# EAGLE design 5draft_onBoard_rework2 (EAGLE 8.1.0)
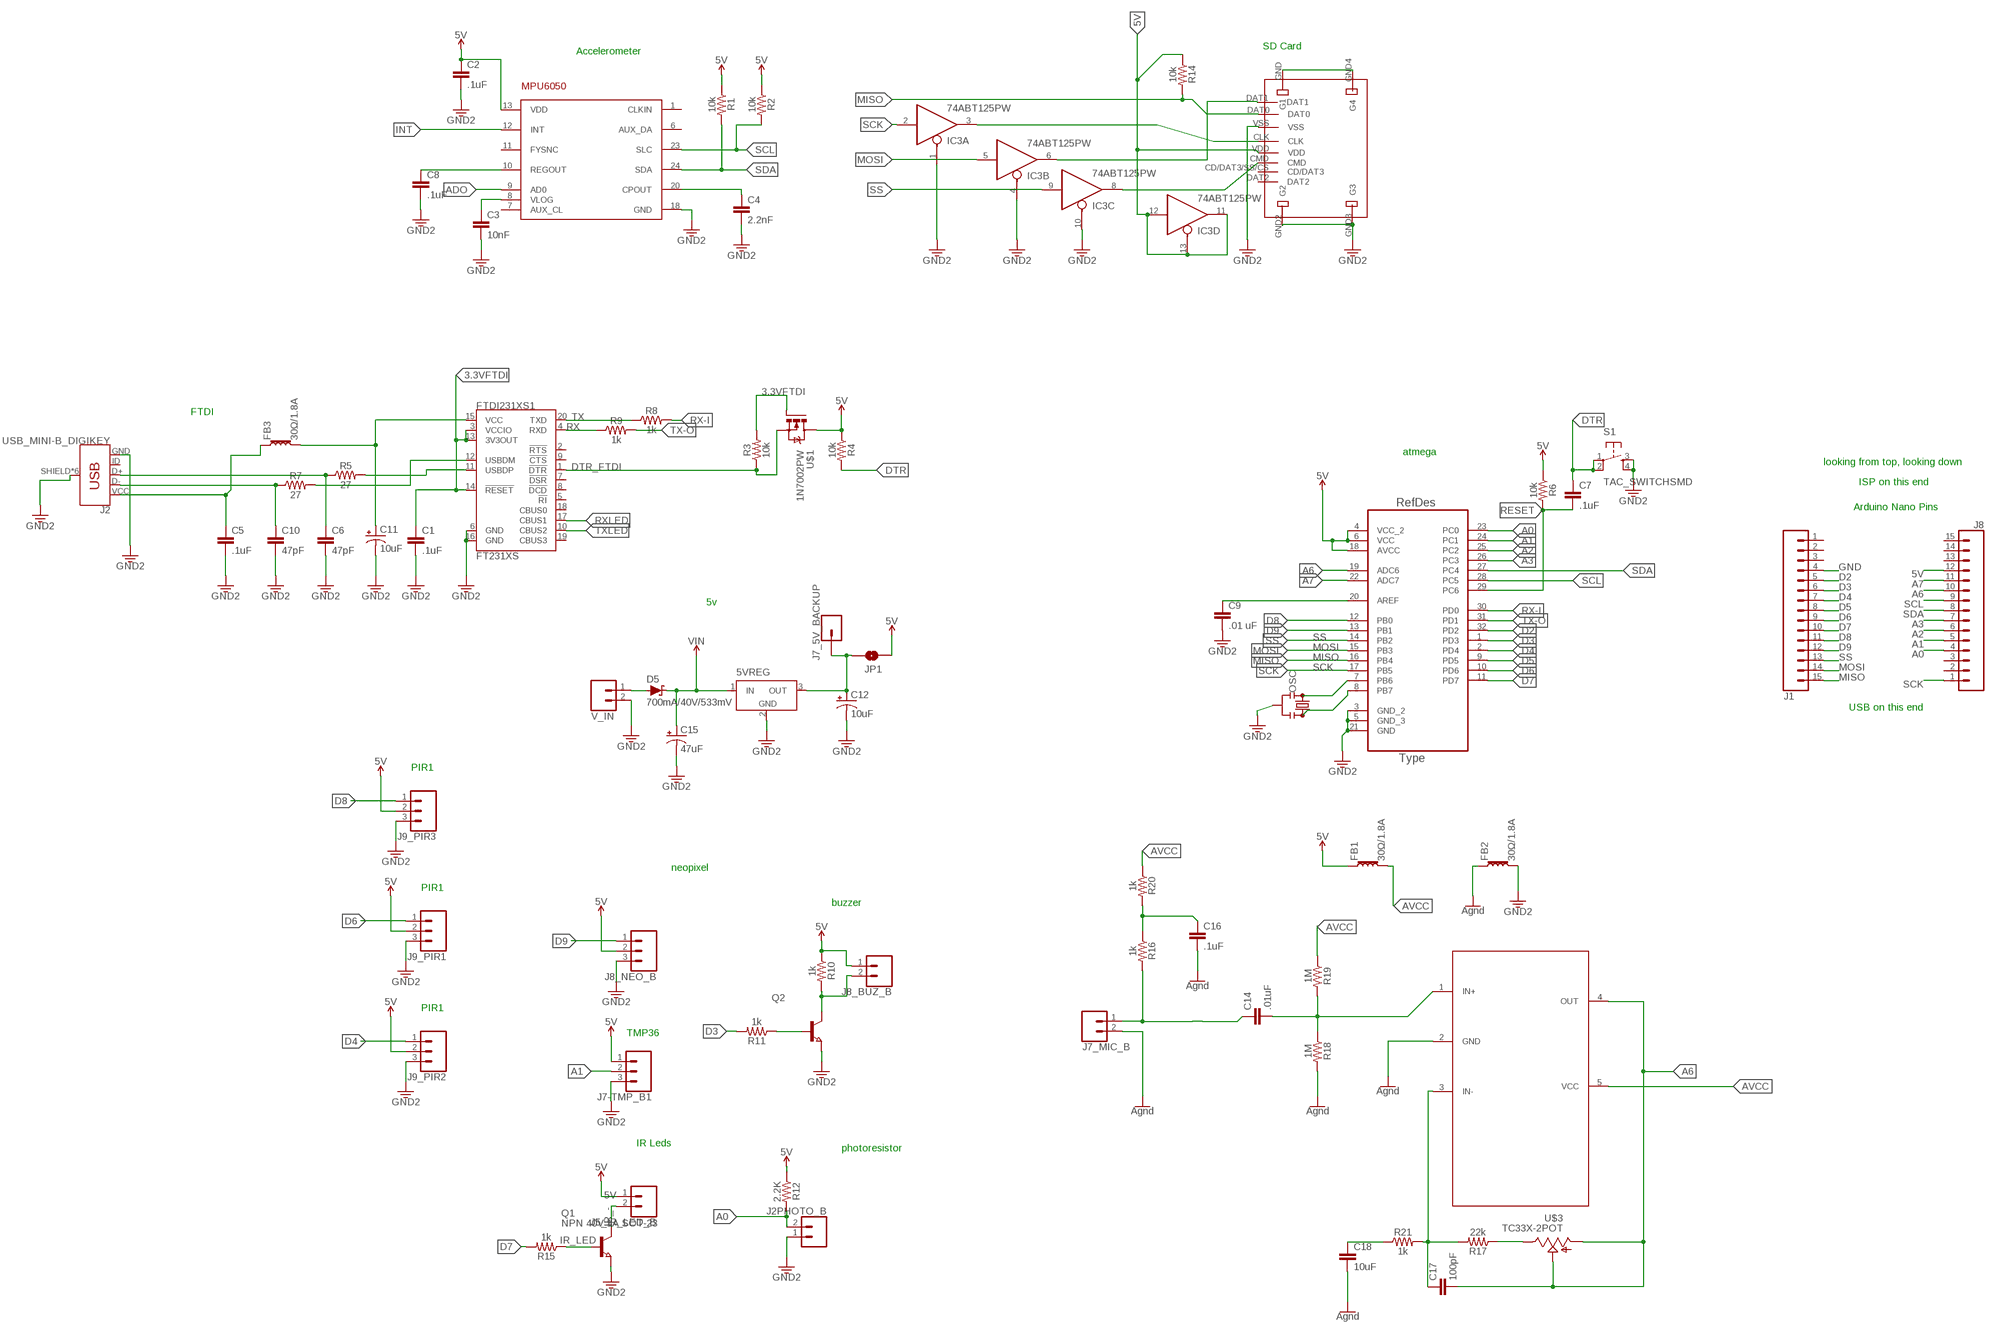
[diagram p0: schematic, sheet 1]

## Parts
5VREG  LT1129CST5  [SOT223]
ATMEGA328P-AU  ATMEGA328P-AU  [QFP80P900X900X120-32N]
C1  .1uF  .22UF-CER  [0402-CAP]
C2  .1uF  .22UF-CER  [0402-CAP]
C3  10nF  .22UF-CER  [0402-CAP]
C4  2.2nF  .22UF-CER  [0402-CAP]
C5  .1uF  .22UF-CER  [0402-CAP]
C6  47pF  .22UF-CER  [0402-CAP]
C7  .1uF  .22UF-CER  [0402-CAP]
C8  .1uF  .22UF-CER  [0402-CAP]
C9  .01 uF  .22UF-CER  [0402-CAP]
C10  47pF  .22UF-CER  [0402-CAP]
C11  10uF  10UF-TANT  [EIA3216]
C12  10uF  10UF-TANT  [EIA3216]
C14  .01uF  .22UF-CER  [0402-CAP]
C15  47uF  10UF-TANT  [EIA3216]
C16  .1uF  .22UF-CER  [0402-CAP]
C17  100pF  .22UF-CER  [0402-CAP]
C18  10uF  .22UF-CER  [0402-CAP]
D5  700mA/40V/533mV  DIODE-SCHOTTKY-ZLLS500  [SOT23-3]
FB1  30Ω/1.8A  FERRITE_BEAD-0603  [0603]
FB2  30Ω/1.8A  FERRITE_BEAD-0603  [0603]
FB3  30Ω/1.8A  FERRITE_BEAD-0603  [0603]
FTDI231XS1  FT231XS  [SSOP20_L]
IC3  74ABT125PW  [TSSOP14]
IC4  MAX4466KS  [SC70-5]
J1  CONN_15  [1X15]
J2  USB_MINI-B_DIGIKEY  [MICRO-USB-DIGIKEY-FCI2]
J2PHOTO_B  CONN_02LOCK  [1X02_LOCK]
J5_IR_LED_B  CONN_02LOCK  [1X02_LOCK]
J7-TMP_B1  CONN_03  [1X03]
J7_5V_BACKUP  CONN_01  [1X01]
J7_MIC_B  CONN_02LOCK  [1X02_LOCK]
J8  CONN_15  [1X15]
J8_BUZ_B  CONN_02LOCK  [1X02_LOCK]
J8_NEO_B  CONN_03  [1X03]
J9_PIR1  CONN_03  [1X03]
J9_PIR2  CONN_03  [1X03]
J9_PIR3  CONN_03  [1X03]
JP1  JUMPER-SMT_2_NO_NO-SILK_ROUND  [SMT-JUMPER_2_NO_NO-SILK_ROUND]
MPU6050  MPU-6050  [QFN24-4X4]
OSC  RESONATORSMD-3.2X1.3  [RESONATOR-SMD-3.2X1.3]
Q1  NPN 40V 1A SOT-23  NPN-TRANSISTOR_SOT23  [SOT23]
Q2  NPN-TRANSISTOR_SOT23  [SOT23]
R1  10k  0.05OHM-0603-1/5W-1%  [0603]
R2  10k  0.05OHM-0603-1/5W-1%  [0603]
R3  10k  0.05OHM-0603-1/5W-1%  [0603]
R4  10k  0.05OHM-0603-1/5W-1%  [0603]
R5  27  0.05OHM-0603-1/5W-1%  [0603]
R6  10k  0.05OHM-0603-1/5W-1%  [0603]
R7  27  0.05OHM-0603-1/5W-1%  [0603]
R8  1k  0.05OHM-0603-1/5W-1%  [0603]
R9  1k  0.05OHM-0603-1/5W-1%  [0603]
R10  1k  0.05OHM-0603-1/5W-1%  [0603]
R11  1k  0.05OHM-0603-1/5W-1%  [0603]
R12  2.2K  0.05OHM-0603-1/5W-1%  [0603]
R14  10k  0.05OHM-0603-1/5W-1%  [0603]
R15  1k  0.05OHM-0603-1/5W-1%  [0603]
R16  1k  0.05OHM-0603-1/5W-1%  [0603]
R17  22k  0.05OHM-0603-1/5W-1%  [0603]
R18  1M  0.05OHM-0603-1/5W-1%  [0603]
R19  1M  0.05OHM-0603-1/5W-1%  [0603]
R20  1k  0.05OHM-0603-1/5W-1%  [0603]
R21  1k  0.05OHM-0603-1/5W-1%  [0603]
S1  TAC_SWITCHSMD  [TACTILE-SWITCH-SMD]
U$1  1N7002PW  [SOT323W_INFINEON]
U$2  WM6698TR-ND_MICROSD  [MICROSD2]
U$3  TC33X-2POT  [TC33X-2]
V_IN  CONN_02LOCK  [1X02_LOCK]

## Nets
2.2NF: C4.1 MPU6050.20(CPOUT)
3.3VFTDI: C1.1 FTDI231XS1.3(VCCIO) FTDI231XS1.13(3V3OUT) FTDI231XS1.14(!RESET) R3.2 U$1.1(G)
5REGOUT: 5VREG.3(OUT) C12.A(+) J7_5V_BACKUP.1 JP1.2
5V: ATMEGA328P-AU.4(VCC_2) ATMEGA328P-AU.6(VCC) ATMEGA328P-AU.18(AVCC) C2.1 FB1.1 IC3.11(D:O) IC3.12(D:I) IC3.13(D:OE) J5_IR_LED_B.1 J7-TMP_B1.1 J8.12 J8_NEO_B.2 J9_PIR1.2 J9_PIR2.2 J9_PIR3.2 JP1.1 MPU6050.13(VDD) R1.1 R2.1 R4.1 R6.1 R12.1 R14.1 U$1.3(D) U$2.VDD
10NF: C3.1 MPU6050.8(VLOG)
.UF: C8.1 MPU6050.10(REGOUT)
A0: ATMEGA328P-AU.23(PC0) J2PHOTO_B.2 J8.4 R12.2
A1: ATMEGA328P-AU.24(PC1) J7-TMP_B1.2 J8.5
A2: ATMEGA328P-AU.25(PC2) J8.6
A3: ATMEGA328P-AU.26(PC3) J8.7
A6: ATMEGA328P-AU.19(ADC6) C17.2 IC4.4(OUT) J8.10 U$3.2 U$3.3
A7: ATMEGA328P-AU.22(ADC7) J8.11
ADO: MPU6050.9(AD0)
AVCC: FB1.2 IC4.5(VCC) R19.1 R20.1
BUZ+: J8_BUZ_B.1 R10.1 ; supply symbol labelled 5V
BUZ-: J8_BUZ_B.2 Q2.3(C) R10.2
D2: ATMEGA328P-AU.32(PD2) J1.5
D3: ATMEGA328P-AU.1(PD3) J1.6 R11.2
D4: ATMEGA328P-AU.2(PD4) J1.7 J9_PIR2.1
D5: ATMEGA328P-AU.9(PD5) J1.8
D6: ATMEGA328P-AU.10(PD6) J1.9 J9_PIR1.1
D7: ATMEGA328P-AU.11(PD7) J1.10 R15.2
D8: ATMEGA328P-AU.12(PB0) J1.11 J9_PIR3.1
D9: ATMEGA328P-AU.13(PB1) J1.12 J8_NEO_B.1
DAT1: IC3.6(B:O) U$2.DAT1
DN+_P: C6.1 J2.D+ R5.1
DN_N: C10.1 J2.D- R7.1
DTR: C7.1 R4.2 S1.1 S1.2
DTR_FTDI: FTDI231XS1.1(!DTR) R3.1 U$1.2(S)
GND: 5VREG.2(GND) ATMEGA328P-AU.3(GND_2) ATMEGA328P-AU.5(GND_3) ATMEGA328P-AU.21(GND) C1.2 C2.2 C3.2 C4.2 C5.2 C6.2 C8.2 C9.2 C10.2 C11.C(-) C12.C(-) C15.C(-) C16.2 C18.2 FB2.1 FB2.2 FTDI231XS1.6(GND) FTDI231XS1.16(GND) IC3.1(A:OE) IC3.4(B:OE) IC3.10(C:OE) IC4.2(GND) J1.4 J2.GND J2.SHIELD J2.SHIELD1(SHIELD) J2.SHIELD2(SHIELD) J2.SHIELD3(SHIELD) J2.SHIELD4(SHIELD) J2.SHIELD5(SHIELD) J2PHOTO_B.1 J7-TMP_B1.3 J7_MIC_B.2 J8_NEO_B.3 J9_PIR1.3 J9_PIR2.3 J9_PIR3.3 MPU6050.18(GND) OSC.2 Q1.2(E) Q2.2(E) R18.2 S1.3 S1.4 U$2.GND2(G2) U$2.GND3(G3) U$2.GND4(G4) U$2.GND(G1) U$2.VSS V_IN.2 ; supply symbol labelled GND2, Agnd
INT: MPU6050.12(INT)
IR_-: J5_IR_LED_B.2 Q1.3(C)
IR_LED: Q1.1(B) R15.1
MIC_IN+: C14.2 IC4.1(IN+) R18.1 R19.2
MIC_IN_C14: C14.1 J7_MIC_B.1 R16.2
MICNET1K: C16.1 R16.1 R20.2
MISO: ATMEGA328P-AU.16(PB4) J1.15 R14.2 U$2.DAT0
MOSI: ATMEGA328P-AU.15(PB3) IC3.5(B:I) J1.14
N$6: ATMEGA328P-AU.20(AREF) C9.1
N$12: R17.1 U$3.1
N$20: Q2.1(B) R11.1
N$22: D5.1(A) V_IN.1
N$29: C18.1 R21.1
N$30: C17.1 IC4.3(IN-) R17.2 R21.2
PB6: ATMEGA328P-AU.7(PB6) OSC.1
PB7: ATMEGA328P-AU.8(PB7) OSC.3
RESET: ATMEGA328P-AU.29(PC6) C7.2 R6.2
RX: FTDI231XS1.4(RXD) R9.1
RX-I: ATMEGA328P-AU.30(PD0) R8.2
RXLED: FTDI231XS1.17(CBUS1)
SCK: ATMEGA328P-AU.17(PB5) IC3.2(A:I) J8.1
SCK_BUFF: IC3.3(A:O) U$2.CLK
SCL: ATMEGA328P-AU.28(PC5) J8.9 MPU6050.23(SLC) R2.2
SDA: ATMEGA328P-AU.27(PC4) J8.8 MPU6050.24(SDA) R1.2
SS: ATMEGA328P-AU.14(PB2) IC3.9(C:I) J1.13
SS_BUFF: IC3.8(C:O) U$2.CMD
TX: FTDI231XS1.20(TXD) R8.1
TX-O: ATMEGA328P-AU.31(PD1) R9.2
TXLED: FTDI231XS1.10(CBUS2)
USBD_M: FTDI231XS1.12(USBDM) R7.2
USBD_P: FTDI231XS1.11(USBDP) R5.2
VIN: 5VREG.1(IN) C15.A(+) D5.3(C)
VUSB: C5.1 C11.A(+) FB3.1 FB3.2 FTDI231XS1.15(VCC) J2.VCC(VBUS)
Unconnected: FTDI231XS1.2(!RTS) FTDI231XS1.5(!RI) FTDI231XS1.7(!DSR) FTDI231XS1.8(!DCD) FTDI231XS1.9(!CTS) FTDI231XS1.18(CBUS0) FTDI231XS1.19(CBUS3) J1.1 J1.2 J1.3 J2.ID J8.2 J8.3 J8.13 J8.14 J8.15 MPU6050.1(CLKIN) MPU6050.6(AUX_DA) MPU6050.7(AUX_CL) MPU6050.11(FYSNC) U$2.CD/DAT3/SS/CS(CD/DAT3) U$2.DAT2

## Notes on the sheet
- SD Card
- Accelerometer
- FTDI
- atmega
- looking from top, looking down
- ISP on this end
- Arduino Nano Pins
- 5v
- USB on this end
- PIR1
- neopixel
- PIR1
- buzzer
- PIR1
- TMP36
- IR Leds
- photoresistor

## Power pins joined to a net without a drawn wire
AVCC: IC3.14(P:VCC)
GND: 5VREG.4(GND) IC3.7(P:GND)

## Library data of the parts
5VREG = linear-technology:LT1129CST5: VOLTAGE REGULATOR with shutdown; MPN: LT1129CST-5#PBF; OC_FARNELL: 1663375; OC_NEWARK: 57M2069
ATMEGA328P-AU = Atmega-328pu:ATMEGA328P-AU; DESCRIPTION: 8-bit Microcontroller with In-System Programmable Flash; MPN: ATMEGA328P-AU; OC_FARNELL: 1715486; OC_NEWARK: 14R4631; PACKAGE: TQFP-32; SUPPLIER: Atmel
C1-C10 C14 C16-C18 = SparkFun-Retired:.22UF-CER: .22uF ceramic SMT CAP-09885- 50V +80%/-20% (0603); PROD_ID: CAP-09885; VALUE: .22uF
C11 C12 = SparkFun-Retired:10UF-TANT: 10uF Tantalum SMT CAP-00811- 16V 10% (EIA-3216); PROD_ID: CAP-00811
C15 = SparkFun-Retired:10UF-TANT: 10uF Tantalum SMT CAP-00811- 16V 10% (EIA-3216); PROD_ID: CAP-00811; VALUE: 10uF
D5 = SparkFun-DiscreteSemi:DIODE-SCHOTTKY: Schottky diode A Schottky diode is a semiconductor diode which has a low forward voltage drop and a very fast switching action.; PROD_ID: DIO-08411
FB1-FB3 = SparkFun-Coils:FERRITE_BEAD: Ferrite Bead (blocks, cores, rings, chokes, etc.) Inductor with layers of ferrite used to suppress high frequencies. Often used to isolate high frequency noise. SparkFun Products: IOIO-OTG - V2.2 <https://www.sparkfun.com/products/13613> SparkFun SAMD21 Mini Breakout <https://www.sparkfun.com/products/13664> SparkFun 6 Degrees of Freedom Breakout - LSM6DS3 <https://www.sparkfun.com/products/13339> SparkFun SAMD21 Dev Breakout <https://www.sparkfun.com/products/13672>; PROD_ID: NDUC-07859
FTDI231XS1 = SparkFun-IC-Comms:FT231X: FTDI FT231X Full Speed USB to Full-handshake UART This USB2.0 Full Speed IC offers a compact bridge to full handshake UART interfaces. The device is a UART, capable of operating up to 3MBaud, with low power consumption (8mA). The FT231X includes the complete FT-X series feature set and enables USB to be added into a system design quickly and easily over a UART interface. Datasheet <http://cdn.sparkfun.com/datasheets/Components/General%20IC/DS_FT231X.pdf> SparkFun Products SparkFun RedBoard - Programmed with Arduino <https://www.sparkfun.com/products/12757> (DEV-12757) SparkFun XBee Explorer USB <https://www.sparkfun.com/products/11812> (WRL-11812) SparkFun XBee Explorer Dongle <https://www.sparkfun.com/products/11697> (WRL-11697) SparkFun Blynk Board - ESP8266 <https://www.sparkfun.com/products/13794> (WRL-13794) SparkFun ESP8266 Thing - Dev Board <https://www.sparkfun.com/products/13711> (WRL-13711) SparkFun Block for Intel® Edison - Base <https://www.sparkfun.com/products/13045> (DEV-13045) SparkFun RedStick <https://www.sparkfun.com/products/13741> (DEV-13741) SparkFun Beefy 3 - FTDI Basic Breakout <https://www.sparkfun.com/products/13746> (DEV-13746) SparkFun FT231X Breakout <https://www.sparkfun.com/products/11736> (BOB-11736); PROD_ID: IC-11524
IC3 = 74xx-us:74*125: Quad bus BUFFER, 3-state
IC4 = KevinKuwata1:MAX4466: MAX4466 SOT23 SC70 mic amp arduino adafruit sparkfun
J1 J8 = SparkFun-Connectors:CONN_15: Multi connection point. Often used as Generic Header-pin footprint for 0.1 inch spaced/style header connections On any of the 0.1 inch spaced packages, you can populate with these: Break Away Headers - Straight <https://www.sparkfun.com/products/116> (PRT-00116) Break Away Male Headers - Right Angle <https://www.sparkfun.com/products/553> (PRT-00553) Female Headers <https://www.sparkfun.com/products/115> (PRT-00115) Break Away Headers - Machine Pin <https://www.sparkfun.com/products/117> (PRT-00117) Break Away Female Headers - Swiss Machine Pin <https://www.sparkfun.com/products/743> (PRT-00743) For SCREWTERMINALS and SPRING TERMINALS visit here: Screw Terimnals on SparkFun.com <https://www.sparkfun.com/search/results?term=Screw+Terminals> (5mm/3.5mm/2.54mm spacing) This device is also useful as a general connection point to wire up your design to another part of your project. Our various solder wires solder well into these plated through hole pads. Hook-Up Wire - Assortment (Stranded, 22 AWG) <https://www.sparkfun.com/products/11375> (PRT-11375) Hook-Up Wire - Assortment (Solid Core, 22 AWG) <https://www.sparkfun.com/products/11367> (PRT-11367) View the entire wire category on our website here <https://www.sparkfun.com/categories/141> Special notes: Molex polarized connector foot print use with SKU : PRT-08231 with associated crimp pins and housings. 1MM SMD Version SKU: PRT-10208 NOTES ON THE VARIANTS LOCK and LOCK_LONGPADS... This footprint was designed to help hold the alignment of a through-hole component (i.e. 6-pin header) while soldering it into place. You may notice that each hole has been shifted either up or down by 0.005 of an inch from it's more standard position (which is a perfectly straight line). This slight alteration caused the pins (the squares in the middle) to touch the edges of the holes. Because they are alternating, it causes a "brace" to hold the component in place. 0.005 has proven to be the perfect amount of "off-center" position when using our standard breakaway headers. Although looks a little odd when you look at the bare footprint, once you have a header in there, the alteration is very hard to notice. Also,if you push a header all the way into place, it is covered up entirely on the bottom side.
J2 = KevinKuwata1:USB_MINI-B_DIGIKEY: USB type Mini-B Connector Breaks out 5th pin, and includes shield pins if needed. SparkFun Products: SparkFun FTDI Basic Breakout <https://www.sparkfun.com/products/9716> SparkFun XBee Explorer USB <https://www.sparkfun.com/products/11812> SparkFun Redboard <https://www.sparkfun.com/products/12757>
J2PHOTO_B J5_IR_LED_B J7_MIC_B J8_BUZ_B V_IN = SparkFun-Connectors:CONN_02: Multi connection point. Often used as Generic Header-pin footprint for 0.1 inch spaced/style header connections On any of the 0.1 inch spaced packages, you can populate with these: Break Away Headers - Straight <https://www.sparkfun.com/products/116> (PRT-00116) Break Away Male Headers - Right Angle <https://www.sparkfun.com/products/553> (PRT-00553) Female Headers <https://www.sparkfun.com/products/115> (PRT-00115) Break Away Headers - Machine Pin <https://www.sparkfun.com/products/117> (PRT-00117) Break Away Female Headers - Swiss Machine Pin <https://www.sparkfun.com/products/743> (PRT-00743) For SCREWTERMINALS and SPRING TERMINALS visit here: Screw Terimnals on SparkFun.com <https://www.sparkfun.com/search/results?term=Screw+Terminals> (5mm/3.5mm/2.54mm spacing) This device is also useful as a general connection point to wire up your design to another part of your project. Our various solder wires solder well into these plated through hole pads. Hook-Up Wire - Assortment (Stranded, 22 AWG) <https://www.sparkfun.com/products/11375> (PRT-11375) Hook-Up Wire - Assortment (Solid Core, 22 AWG) <https://www.sparkfun.com/products/11367> (PRT-11367) View the entire wire category on our website here <https://www.sparkfun.com/categories/141> Special notes: Molex polarized connector foot print use with: PRT-08233 with associated crimp pins and housings. 2.54_SCREWTERM for use with PRT-10571. 3.5mm Screw Terminal footprints for PRT-08084 5mm Screw Terminal footprints for use with PRT-08432
J7-TMP_B1 J8_NEO_B J9_PIR1-J9_PIR3 = SparkFun-Connectors:CONN_03: Multi connection point. Often used as Generic Header-pin footprint for 0.1 inch spaced/style header connections On any of the 0.1 inch spaced packages, you can populate with these: Break Away Headers - Straight <https://www.sparkfun.com/products/116> (PRT-00116) Break Away Male Headers - Right Angle <https://www.sparkfun.com/products/553> (PRT-00553) Female Headers <https://www.sparkfun.com/products/115> (PRT-00115) Break Away Headers - Machine Pin <https://www.sparkfun.com/products/117> (PRT-00117) Break Away Female Headers - Swiss Machine Pin <https://www.sparkfun.com/products/743> (PRT-00743) Stackable Header - 3 Pin (Female, 0.1") <https://www.sparkfun.com/products/13875> (PRT-13875) For SCREWTERMINALS and SPRING TERMINALS visit here: Screw Terimnals on SparkFun.com <https://www.sparkfun.com/search/results?term=Screw+Terminals> (5mm/3.5mm/2.54mm spacing) This device is also useful as a general connection point to wire up your design to another part of your project. Our various solder wires solder well into these plated through hole pads. Hook-Up Wire - Assortment (Stranded, 22 AWG) <https://www.sparkfun.com/products/11375> (PRT-11375) Hook-Up Wire - Assortment (Solid Core, 22 AWG) <https://www.sparkfun.com/products/11367> (PRT-11367) View the entire wire category on our website here <https://www.sparkfun.com/categories/141> Special notes: Molex polarized connector foot print use with SKU : PRT-08232 with associated crimp pins and housings.
J7_5V_BACKUP = SparkFun-Connectors:CONN_01: Single connection point. Often used as Generic Header-pin footprint for 0.1 inch spaced/style header connections On any of the 0.1 inch spaced packages, you can populate with these: Break Away Headers - Straight <https://www.sparkfun.com/products/116> (PRT-00116) Break Away Male Headers - Right Angle <https://www.sparkfun.com/products/553> (PRT-00553) Female Headers <https://www.sparkfun.com/products/115> (PRT-00115) Break Away Headers - Machine Pin <https://www.sparkfun.com/products/117> (PRT-00117) Break Away Female Headers - Swiss Machine Pin <https://www.sparkfun.com/products/743> (PRT-00743) This device is also useful as a general connection point to wire up your design to another part of your project. Our various solder wires solder well into these plated through hole pads. Hook-Up Wire - Assortment (Stranded, 22 AWG) <https://www.sparkfun.com/products/11375> (PRT-11375) Hook-Up Wire - Assortment (Solid Core, 22 AWG) <https://www.sparkfun.com/products/11367> (PRT-11367) View the entire wire category on our website here <https://www.sparkfun.com/categories/141> Special notes: SMTSO-256-ET is a "flush mount" nut for a 4-40 screw. We mostly use this on specialty testbeds; it is a nice way to connect hardware to your PCB at an adjustable hieght. Also note, the SNAP packages are for using a snappable style connector. We sell a baggie of snaps and they are also used on two LilyPad designs: Snap Assortment - 30 pack (male and female) <https://www.sparkfun.com/products/11347> (DEV-11347) LilyPad Arduino SimpleSnap <https://www.sparkfun.com/products/10941> (DEV-10941) LilyPad SimpleSnap Protoboard <https://www.sparkfun.com/products/10940> (DEV-10940)
JP1 = SparkFun-Jumpers:JUMPER-SMT_2_NO: Normally open jumper This jumper has two pads in close proximity to each other. Apply solder to close the connection. Round pads are easier to solder for beginners, but are a lot larger. SparkFun Product that uses the round pads: SparkFun EL Sequencer <https://www.sparkfun.com/products/12781>
MPU6050 = KevinKuwata1:MPU-6050
OSC = SparkFun-Clocks:RESONATOR: Resonators (Generic) Ceramic resonators are clock-generating components, often used to control timing in microcontrollers. They usually have 3 pins: two pins for oscillation, and one pin for ground. Compared to crystals, resonators have worse tolerance, but are usually much cheaper. Plus, they have built-in load capacitors! These devices are used on boards like the Arduino Pro 8MHz <https://www.sparkfun.com/products/11114> and Arduino Pro 16MHz <https://www.sparkfun.com/products/11113>.
Q1 Q2 = semicon-smd-ipc:NPN-TRANSISTOR_: NPN TRANSISTOR
R1-R12 R14-R21 = SparkFun-Resistors:0.05OHM: 0.05Ω resistor A resistor is a passive two-terminal electrical component that implements electrical resistance as a circuit element. Resistors act to reduce current flow, and, at the same time, act to lower voltage levels within circuits. - Wikipedia; PROD_ID: RES-12535; VALUE: 0.05
S1 = SparkFun-Retired:TAC_SWITCH: Momentary Switch Button commonly used for reset or general input. Spark Fun Electronics SKU : COM-00097 SMT- SWCH-08247; PROD_ID: SWCH-08247
U$1 = KevinKuwata1:1N7002PW
U$2 = KevinKuwata1:WM6698TR-ND_MICROSD
U$3 = KevinKuwata1:TC33X-2POT

## Net classes
0 default: clearance 0.051 mm

## Board
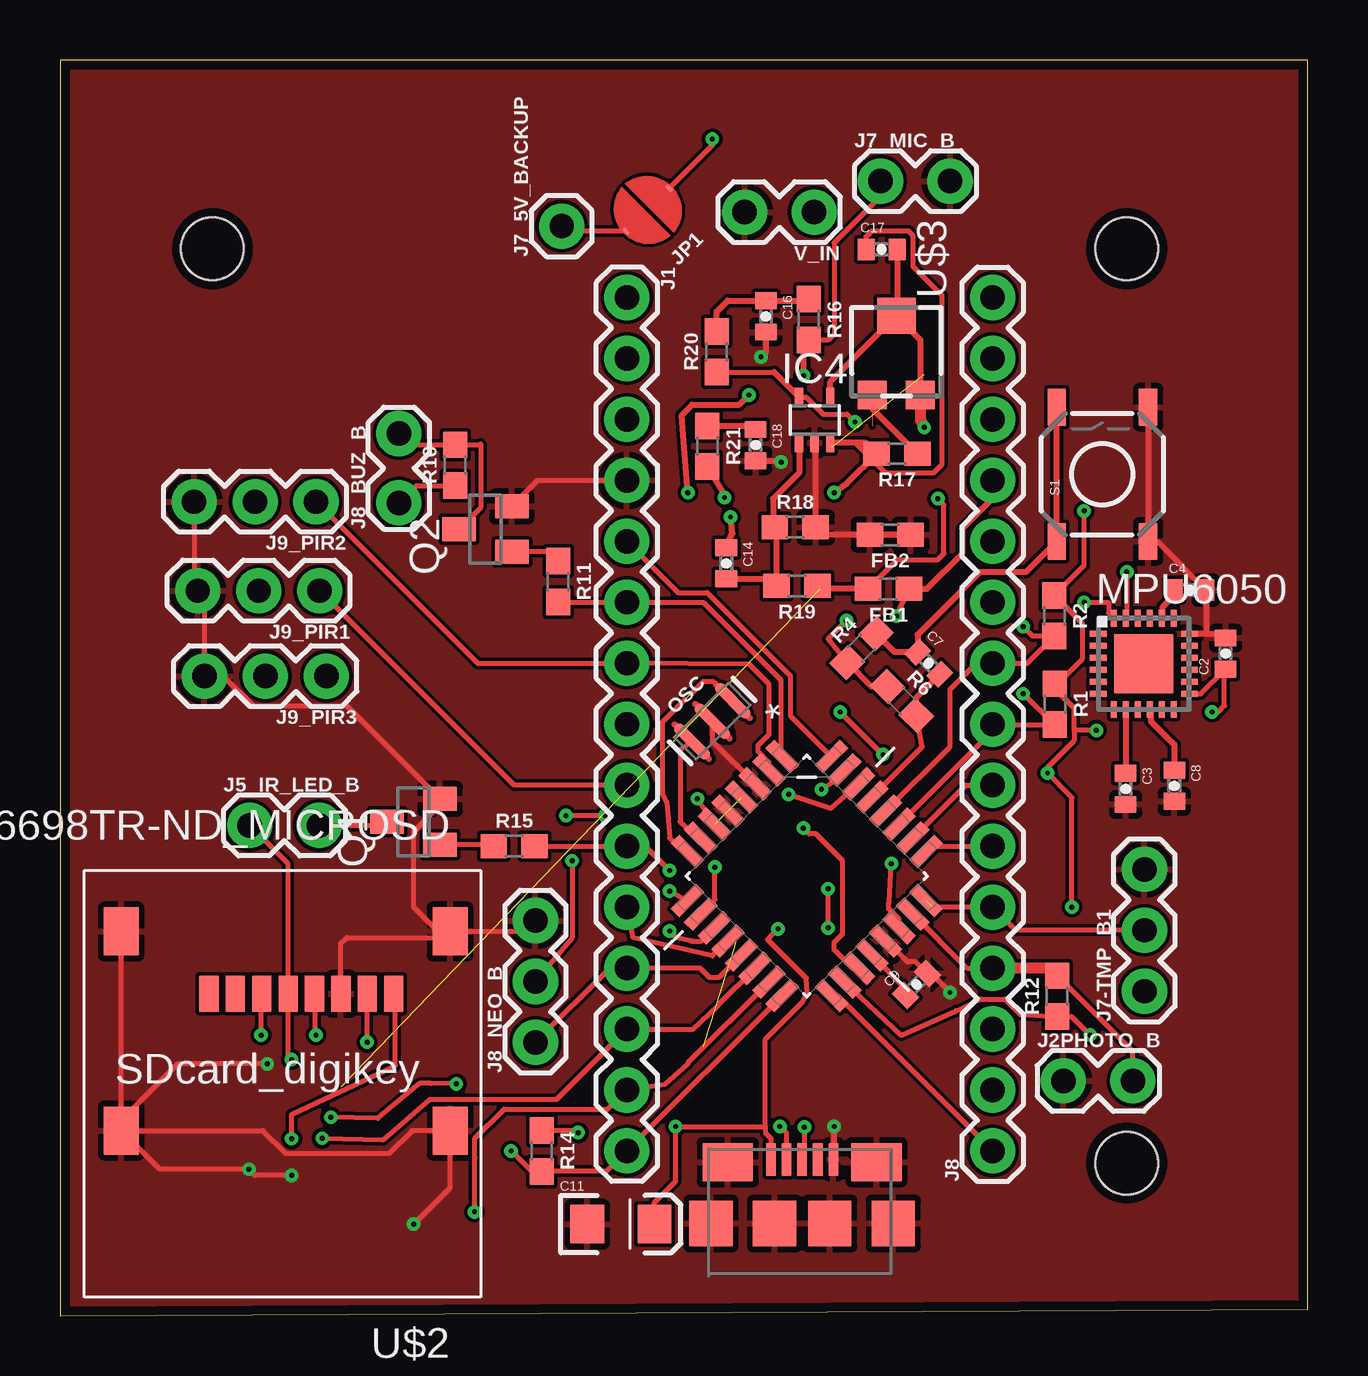
[diagram p1: board, top side]
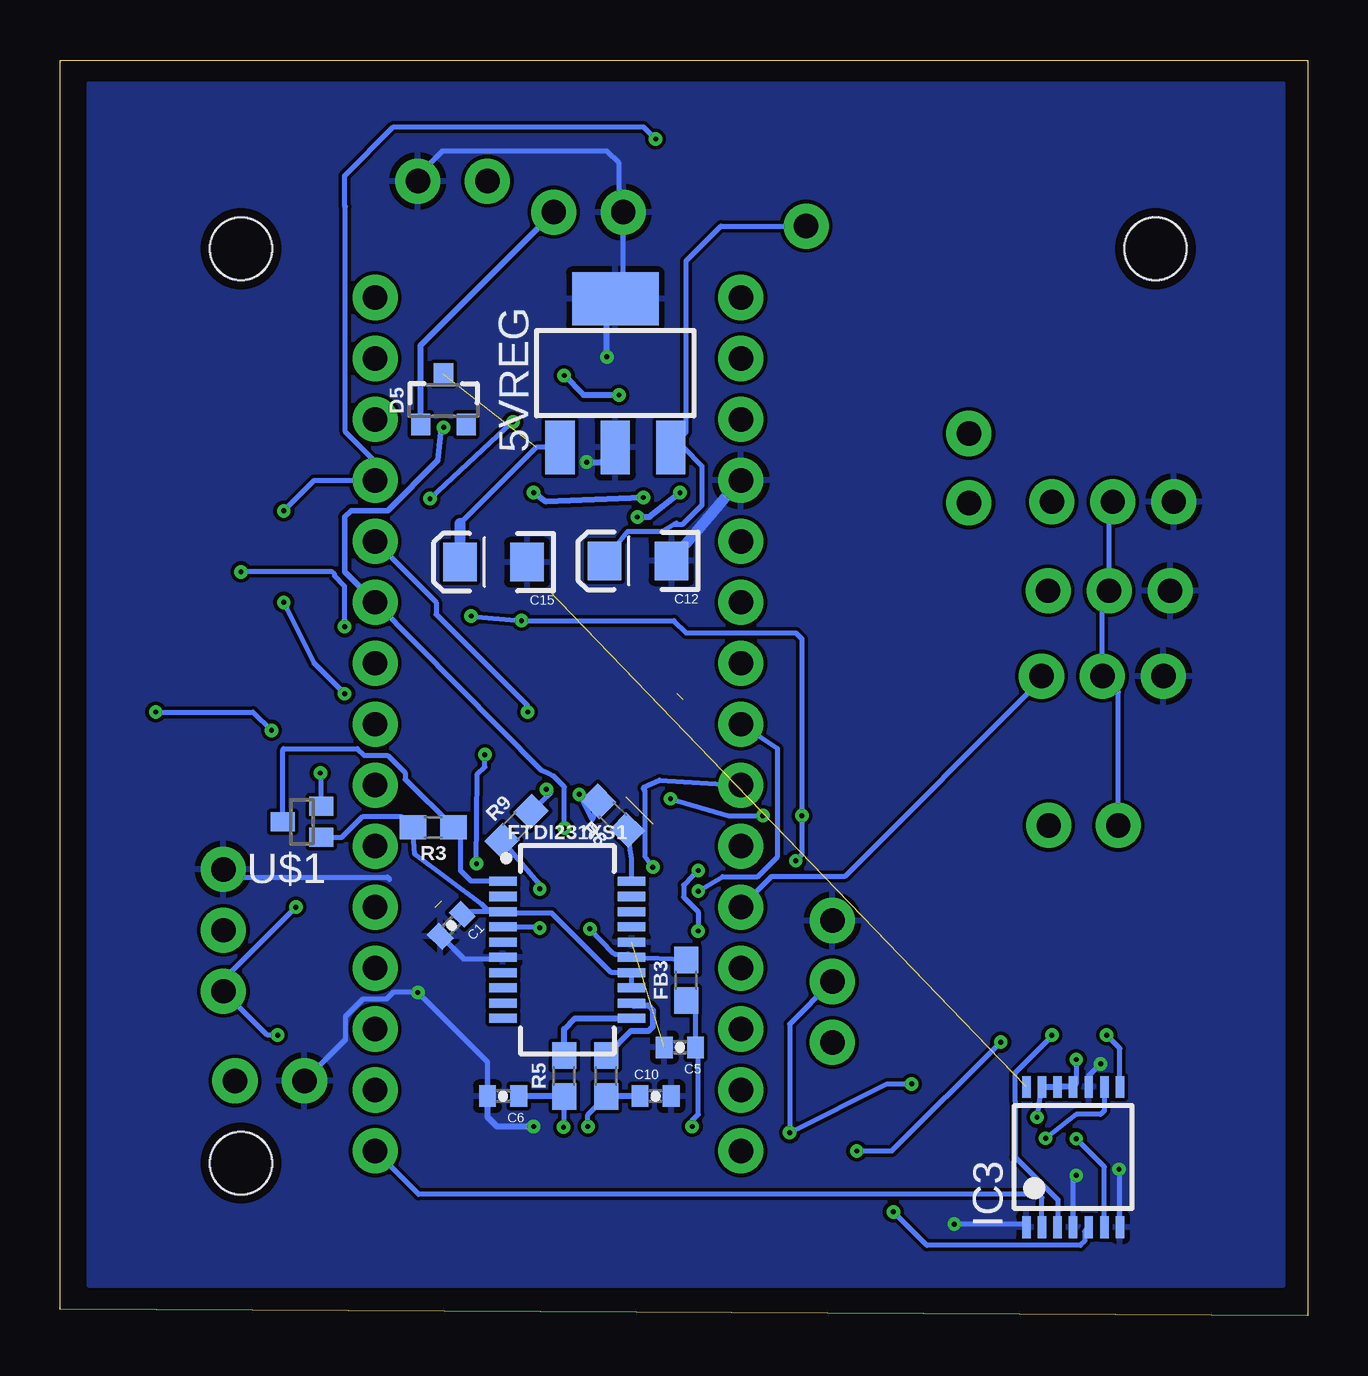
[diagram p2: board, bottom side, seen from below]

Size 51.99 x 52.31 mm. Coordinates in mm from the lower left corner, seen from the top.
Outline: 0,0 51.99,0.25 51.99,52.31 0,52.31 0,0
Copper layers (1*16): Top 0.0356mm / dielectric 1.5011mm / Bottom 0.0356mm
Design rules "OSHPARKLaenPCBOrder": minimum track width 6mil, minimum drill 13mil, track to track 6mil, track to pad 6mil, pad to pad 6mil, via to via 6mil, smd to smd 6mil, copper to edge 15mil, drill to drill 6mil, minimum pad ring 7mil, minimum via ring 7mil, stop-mask expansion 3mil, vias tented up to drill 0mil, thermal gap 10mil
Holes 2.6 mm at 6.35,44.45 44.45,44.45 44.45,6.35

### Footprints (pad centres in the part's own frame; a part is rotated, then mirrored left to right if it is on the bottom)
SOT223 = smd 1.219 x 2.235: 1 -2.311,-3.099; 2 0,-3.099; 3 2.311,-3.099 | smd 3.6 x 2.2: 4 0,3.099
QFP80P900X900X120-32N = smd 1.473 x 0.508: 1 -4.242,2.794; 2 -4.242,2.007; 3 -4.242,1.194; 4 -4.242,0.406; 5 -4.242,-0.406; 6 -4.242,-1.194; 7 -4.242,-2.007; 8 -4.242,-2.794; 17 4.242,-2.794; 18 4.242,-2.007; 19 4.242,-1.194; 20 4.242,-0.406; 21 4.242,0.406; 22 4.242,1.194; 23 4.242,2.007; 24 4.242,2.794 | smd 0.508 x 1.473: 9 -2.794,-4.242; 10 -2.007,-4.242; 11 -1.194,-4.242; 12 -0.406,-4.242; 13 0.406,-4.242; 14 1.194,-4.242; 15 2.007,-4.242; 16 2.794,-4.242; 25 2.794,4.242; 26 2.007,4.242; 27 1.194,4.242; 28 0.406,4.242; 29 -0.406,4.242; 30 -1.194,4.242; 31 -2.007,4.242; 32 -2.794,4.242
0402-CAP = smd 0.7 x 0.9: 1 -0.65,0; 2 0.65,0
EIA3216 = smd 1.4 x 1.6: A 1.4,0; C -1.4,0
SOT23-3 = smd 0.8 x 0.9: 1 -0.95,-1; 2 0.95,-1; 3 0,1.1
0603 = smd 1.1 x 1: 1 -0.85,0; 2 0.85,0
SSOP20_L = smd 0.381 x 1.143: 1 -2.857,-2.68; 2 -2.223,-2.68; 3 -1.587,-2.68; 4 -0.953,-2.68; 5 -0.318,-2.68; 6 0.318,-2.68; 7 0.953,-2.68; 8 1.587,-2.68; 9 2.223,-2.68; 10 2.857,-2.68; 11 2.857,2.68; 12 2.223,2.68; 13 1.587,2.68; 14 0.953,2.68; 15 0.318,2.68; 16 -0.318,2.68; 17 -0.953,2.68; 18 -1.587,2.68; 19 -2.223,2.68; 20 -2.857,2.68
TSSOP14 = smd 0.35 x 0.9: 1 -1.95,-2.925; 2 -1.3,-2.925; 3 -0.65,-2.925; 4 0,-2.925; 5 0.65,-2.925; 6 1.3,-2.925; 7 1.95,-2.925; 8 1.95,2.925; 9 1.3,2.925; 10 0.65,2.925; 11 0,2.925; 12 -0.65,2.925; 13 -1.3,2.925; 14 -1.95,2.925
SC70-5 = smd 0.35 x 0.8: 1 -0.65,-0.95; 2 0,-0.95; 3 0.65,-0.95; 4 0.65,0.95; 5 -0.65,0.95
1X15 = drill 1.016 pad 1.88: 1 0,0; 2 2.54,0; 3 5.08,0; 4 7.62,0; 5 10.16,0; 6 12.7,0; 7 15.24,0; 8 17.78,0; 9 20.32,0; 10 22.86,0; 11 25.4,0; 12 27.94,0; 13 30.48,0; 14 33.02,0; 15 35.56,0
MICRO-USB-DIGIKEY-FCI2 = smd 0.4 x 1.35: D+ 0,2.67; D- -0.65,2.67; GND 1.3,2.67; ID 0.65,2.67; VCC -1.3,2.67 | smd 2.1 x 1.6: SHIELD -3.1,2.55; SHIELD1 3.1,2.55 | smd 1.8 x 1.9: SHIELD2 -3.8,0; SHIELD3 -1.15,0; SHIELD4 1.15,0; SHIELD5 3.8,0
1X02_LOCK = drill 1.016 pad 1.88: 1 -0.178,0; 2 2.718,0
1X03 = drill 1.016 pad 1.88: 1 0,0; 2 2.54,0; 3 5.08,0
1X01 = drill 1.016 pad 1.88: 1 0,0
SMT-JUMPER_2_NO_NO-SILK_ROUND = smd 0.152 x 0.305: 1 -1.27,0; 2 1.27,0
QFN24-4X4 = smd 0.7 x 0.25: 1 -1.9,1.25; 2 -1.9,0.75; 3 -1.9,0.25; 4 -1.9,-0.25; 5 -1.9,-0.75; 6 -1.9,-1.25; 13 1.9,-1.25; 14 1.9,-0.75; 15 1.9,-0.25; 16 1.9,0.25; 17 1.9,0.75; 18 1.9,1.25 | smd 0.25 x 0.7: 7 -1.25,-1.9; 8 -0.75,-1.9; 9 -0.25,-1.9; 10 0.25,-1.9; 11 0.75,-1.9; 12 1.25,-1.9; 19 1.25,1.9; 20 0.75,1.9; 21 0.25,1.9; 22 -0.25,1.9; 23 -0.75,1.9; 24 -1.25,1.9 | smd 2.45 x 2.45: EXP 0,0
RESONATOR-SMD-3.2X1.3 = smd 0.45 x 1.905: 1 -1.2,0; 2 0,0; 3 1.2,0
SOT23 = smd 1 x 1.4: 1 -0.95,-1.1; 2 0.95,-1.1; 3 0,1.1
TACTILE-SWITCH-SMD = smd 1.524 x 0.762: 1 -2.794,1.905; 2 2.794,1.905; 3 -2.794,-1.905; 4 2.794,-1.905
SOT323W_INFINEON = smd 1 x 0.8: 1 -0.8,0.65; 2 0.8,0; 3 -0.8,-0.65
MICROSD2 = smd 0.8 x 1.5: CD/DAT3/SS/CS 8.95,2.6; CLK 5.65,2.6; CMD 7.85,2.6; DAT0 3.45,2.6; DAT1 2.35,2.6; DAT2 10.05,2.6; VDD 6.75,2.6; VSS 4.55,2.6 | smd 1.45 x 2: GND 0,8.3; GND2 13.7,8.3; GND3 13.7,0; GND4 0,0
TC33X-2 = smd 1.2 x 1.2: 1 -1.8,1; 3 -1.8,-1 | smd 1.5 x 1.6: 2 1.5,0

### Placement (x,y rotation side)
5VREG  28.85,39.27 0 bottom
ATMEGA328P-AU  31.11,18.31 315 top
C1  35.69,16.26 225 bottom
C2  48.56,27.58 90 top
C3  44.4,21.95 270 top
C4  47.09,30.23 0 top
C5  26.16,11.18 180 bottom
C6  33.53,9.14 180 bottom
C7  36.2,27.18 315 top
C8  46.43,22.07 270 top
C9  35.69,13.79 45 top
C10  27.18,9.14 0 bottom
C11  23.37,3.81 0 top
C12  27.91,31.45 180 bottom
C14  27.76,31.34 270 top
C15  33.93,31.39 180 bottom
C16  29.41,41.63 270 top
C17  34.24,44.42 0 top
C18  28.98,36.27 270 top
D5  36.02,38.13 0 bottom
FB1  34.52,30.28 180 top
FB2  34.59,32.54 180 top
FB3  25.91,13.97 90 bottom
FTDI231XS1  30.86,15.24 270 bottom
IC3  9.78,6.6 0 bottom
IC4  31.45,37.31 0 top
J1  23.62,42.42 270 top
J2  30.92,3.84 0 top
J2PHOTO_B  41.99,9.78 0 top
J5_IR_LED_B  8.08,20.42 0 top
J7-TMP_B1  45.19,13.51 90 top
J7_5V_BACKUP  20.9,45.39 90 top
J7_MIC_B  34.37,47.27 0 top
J8  38.86,6.86 90 top
J8_BUZ_B  14.12,34.04 90 top
J8_NEO_B  19.81,11.38 90 top
J9_PIR1  10.82,30.2 180 top
J9_PIR2  10.67,33.91 180 top
J9_PIR3  11.1,26.64 180 top
JP1  24.49,46.08 225 top
MPU6050  45.16,27.15 0 top
OSC  27.18,24.77 45 top
Q1  14.73,20.57 90 top
Q2  17.73,32.77 90 top
R1  41.45,25.48 270 top
R2  41.43,29.16 270 top
R3  36.44,20.34 180 bottom
R4  33.4,27.81 45 top
R5  30.99,9.98 90 bottom
R6  35.08,25.6 315 top
R7  29.24,9.98 90 bottom
R8  28.96,20.83 135 bottom
R9  32.97,20.4 45 bottom
R10  16.46,35.43 90 top
R11  20.75,30.58 270 top
R12  41.55,13.31 90 top
R14  20.07,6.86 270 top
R15  18.92,19.56 0 top
R16  31.19,41.5 270 top
R17  34.87,35.92 180 top
R18  30.63,32.84 0 top
R19  30.71,30.4 180 top
R20  27.36,40.16 90 top
R21  26.97,36.22 270 top
S1  43.43,35.05 90 top
U$1  41.91,20.57 180 bottom
U$2  16.26,16 180 top
U$3  34.85,40.16 90 top
V_IN  31.24,45.97 180 top

### Tracks (layer width: path | path; a pad name or v marks a point on that pad's centre or on a via)
2.2NF
  Top 0.254: MPU6050.20 | MPU6050.20 45.93,29.07 | MPU6050.20 45.96,29.1 45.96,29.54 46.44,30.02 C4.1
3.3VFTDI
  Bottom 0.203: FTDI231XS1.3 34.1,16.83 34.42,17.15 37.21,19.22 R3.2 37.78,20.8 39.38,20.8 40.26,19.92 U$1.1 | FTDI231XS1.13 FTDI231XS1.14 29.02,14.29 31.5,16.76 33.48,16.76 FTDI231XS1.3 | FTDI231XS1.3 35.12,16.83 C1.1
5REGOUT
  Top 0.203: J7_5V_BACKUP.1 21.12,45.18 JP1.2
  Bottom 0.203: J7_5V_BACKUP.1 24.46,45.39 25.91,43.94 25.91,36.8 5VREG.3 26.01,36.17 25.24,35.4 25.24,33.78 26.04,32.98 26.39,32.98 | C12.A 28.35,32.66 26.92,32.66 26.39,32.98 | 26.31,33.02 26.39,32.98
5V  (via drill 0.2)  (1 unrouted)
  Top 0.203: R12.1 41.9,12.46 | v9.65,10.67 9.51,10.81 U$2.VDD 9.51,18.82 J5_IR_LED_B.1 | v42.67,33.53 42.67,31.25 R2.1 42.61,28.83 42.61,27.37 41.57,26.33 R1.1 41.45,26.11 42.26,25.3 42.26,24.38 | 42.26,24.38 42.26,23.95 41.15,22.84 v41.15,22.61 42.16,21.59 v42.16,17.02 | 47.25,25.9 MPU6050.13 47.53,25.9 C2.1 48.51,26.88 48.51,25.4 48.26,25.15 v48.01,25.15 | v43.18,24.38 42.26,24.38 | R12.1 42.15,12.46 v42.93,11.68 | R14.1 21.5,7.71 v21.59,7.62 | v16.51,9.65 15.46,9.68 14.99,9.68 13.24,8.21 v11.28,8.26 | R4.1 32,28.19 v32.77,28.96 | v34.86,29.15 FB1.1 | v27.18,49.02 27.18,48.77 JP1.1 | v21.34,18.95 21.34,15.75 J8_NEO_B.2 | ATMEGA328P-AU.6 v26.56,21.53 | v22.71,20.83 v21.08,20.83 | ATMEGA328P-AU.18 35.05,11.68 37.34,12.7 37.34,12.68 38.35,13.18 39.38,13.18 40.01,12.55 R12.1
  Top 0.254: MPU6050.13 | FB1.1 36.12,30.28 37.59,31.75 37.59,32.78 38.86,34.05 J8.12 | R6.1 33.81,26.2 R4.1
  Bottom 0.203: v9.65,10.67 9.65,9.66 IC3.11 | J5_IR_LED_B.1 7.9,25.98 J9_PIR3.2 8.56,29.92 J9_PIR1.2 8.28,33.76 J9_PIR2.2 | v42.67,33.53 41.4,34.8 J8.12 38.86,35.58 40.11,36.82 40.11,46.2 40.13,46.23 40.13,47.5 38.1,49.53 27.69,49.53 v27.18,49.02 | U$1.3 41.11,22.57 v41.15,22.61 | v48.01,25.15 43.94,25.15 v43.18,24.38 | v42.93,11.68 43.36,11.68 J7-TMP_B1.1 45.19,13.99 v42.16,17.02 | J8_NEO_B.2 21.59,12.14 v21.59,7.62 17.53,9.65 v16.51,9.65 | v11.28,8.26 IC3.13 | v34.86,29.15 v32.77,28.96 26.42,28.96 25.91,28.45 21.34,28.45 21.08,28.19 v21.08,20.83 21.08,19.2 v21.34,18.95 | v26.56,21.53 24.12,20.82 v22.71,20.83
  Bottom 0.254: IC3.11 IC3.12 IC3.13
10NF
  Top 0.254: MPU6050.8 44.41,22.61 C3.1
.UF
  Top 0.254: MPU6050.10 45.46,25.21 45.46,24.77 46.43,23.79 C8.1
A0
  Top 0.203: ATMEGA328P-AU.23 37.79,14.48 J8.4 | J2PHOTO_B.2 44.7,11.01 R12.2
  Top 0.457: J8.4 41.57,14.48 R12.2
A1  (1 unrouted)
  Top 0.203: 36.36,17.02 J8.5 39.83,16.05 J7-TMP_B1.2
A2
  Top 0.203: ATMEGA328P-AU.25 36.31,19.56 J8.6
A3
  Top 0.203: ATMEGA328P-AU.26 37.74,22.1 J8.7
A6  (via drill 0.2)
  Top 0.203: 33.1,14.47 ATMEGA328P-AU.19 33.03,14.47 32.26,15.24 32.26,15.55 32.61,15.9 32.61,18.95 31.5,20.07 31.21,20.07 v30.97,20.31
  Top 0.254: U$3.3 35.85,40.66 U$3.2 | IC4.4 32.09,38.9 U$3.2 | C17.2 34.89,41.7 U$3.2
  Top 0.457: U$3.3 35.85,37.3 v36.01,37
  Bottom 0.203: J8.10 31.93,22.71 31.64,22.59 31.42,22.48 30.97,22.03 v30.97,20.31
  Bottom 0.229: v36.01,37 36.12,36.77 36.25,35.63 38.34,33.54 39.87,33.54 40.13,33.27 40.13,30.99 J8.10
A7  (via drill 0.2)
  Top 0.203: v32.51,25.15 v34.29,23.37 | ATMEGA328P-AU.22 34.96,16.52 34.53,16.95 34.53,17.2 34.54,17.22 v34.64,18.83
  Bottom 0.203: J8.11 36.32,29.72 36.32,29.21 32.51,25.4 v32.51,25.15 | v34.29,23.37 34.29,22.86 34.61,22.57 v34.64,18.83
AVCC  (via drill 0.2)  (1 unrouted)
  Top 0.203: R20.1 29.75,39.31 | IC4.5 31.09,38.26 31.79,37.56 32.8,37.56 v33.13,37.23 | FB1.2 34.89,31.5 36.58,31.5 36.83,31.75 36.83,33.78 v36.58,34.04
  Top 0.254: 29.75,39.31 IC4.5 | FB1.2 31.69,30.28 R19.1
  Bottom 0.203: v33.13,37.23 v36.58,34.04
BUZ+
  Top 0.203: J8_BUZ_B.1 14.85,34.58 R10.1
BUZ-
  Top 0.203: J8_BUZ_B.2 14.59,36.28 R10.2 17.49,36.28 17.53,36.32 17.53,33.66 Q2.3
D2
  Top 0.203: ATMEGA328P-AU.32 30.43,25 30.43,26.66 26.96,30.12 25.76,30.12 J1.5
D3
  Top 0.203: ATMEGA328P-AU.1 30.02,23.36 30.02,26.49 26.8,29.72 J1.6 20.77,29.72 R11.2
D4
  Top 0.203: ATMEGA328P-AU.2 29.53,23.05 29.09,23.5 29.09,23.76 29.53,24.2 29.53,26.32 28.73,27.13 J1.7 | J1.7 23.67,27.13 | J9_PIR2.1 17.4,27.18 J1.7
D5  (via drill 0.2)
  Top 0.203: ATMEGA328P-AU.9 v25.4,17.68
  Bottom 0.203: v25.4,17.68 24.38,18.29 22.93,18.29 22.1,19.12 22.1,23.62 J1.8
D6  (via drill 0.2)
  Top 0.203: J1.9 18.92,22.1 J9_PIR1.1 | ATMEGA328P-AU.10 27.29,17.32 v27.29,18.68
  Bottom 0.203: J1.9 27.02,22.31 27.69,22 27.61,21.82 27.61,19.12 v27.29,18.68
D7  (via drill 0.2)
  Top 0.203: R15.2 J1.10 24.38,19.56 v25.4,18.54 | 25.68,15.75 | 25.68,15.75 v25.4,16.02 25.68,15.75 | 26.28,15.61 26.35,15.6 26.71,15.6 ATMEGA328P-AU.11 27.16,16.16 | 26.28,15.61 | 26.28,15.61 25.68,15.75
  Bottom 0.203: v25.4,18.54 25.65,18.3 26.01,17.94 26.01,17.43 25.4,16.83 v25.4,16.02
D8
  Top 0.203: ATMEGA328P-AU.12 27.79,15.6 27.18,14.99 23.88,15.75 J1.11
  Bottom 0.203: J9_PIR3.1 11.1,26.49 19.3,18.29 22.35,18.29 J1.11
D9
  Top 0.203: ATMEGA328P-AU.13 27.47,14.1 27.05,14.1 26.67,14.48 J1.12 22.91,14.48 J8_NEO_B.1
DAT1  (via drill 0.2)
  Top 0.203: v9.65,7.37 9.65,8.38 13.97,10.41 13.97,13.34 U$2.DAT1
  Bottom 0.203: IC3.6 8.48,6.19 v9.65,7.37
DN+_P  (via drill 0.2)
  Top 0.203: v31.01,7.85 31.01,6.5 J2.D+
  Bottom 0.203: R5.1 30.99,7.85 v31.01,7.85 | C6.1 32.87,9.13
  Bottom 0.254: R5.1 31,9.14 C6.1
DN_N  (via drill 0.2)
  Top 0.203: 30.23,6.55 arc90 J2.D- 30.27,7.6 v30,7.87
  Bottom 0.203: v30,7.87 30,8.37 R7.1
  Bottom 0.254: C10.1 R7.1
DTR
  Top 0.254: S1.2 S1.1 40.26,30.99 38.34,30.99 37.59,30.24 37.59,30.23 35.73,28.37 C7.1 34.78,27.64 R4.2
DTR_FTDI
  Bottom 0.203: U$1.2 42.71,23.58 42.67,23.62 39.61,23.62 39.33,23.34 38.35,23.34 37.62,22.61 37.62,22.34 R3.1 35.31,20.03 35.31,18.54 34.86,18.1 FTDI231XS1.1
GND  (via drill 0.2)  (1 unrouted)
  Top 0.203: 2.56,8.13 U$2.GND2 | 2.56,8.13 U$2.GND3 | ATMEGA328P-AU.21 34.44,15.6 35.31,14.73 35.67,14.73 C9.2 36.29,14.25 v37.08,13.46 | ATMEGA328P-AU.3 27.18,23.94 OSC.2 27.3,24.64 | U$2.GND2 8.45,7.7 9.4,6.76 13.73,6.76 14.68,7.7 U$2.GND 16.26,5.33 v14.73,3.81 | U$2.GND2 4.16,6.1 v7.87,6.1 8.12,5.84 v9.65,5.84 | U$2.VSS 11.71,15.52 11.94,15.75 16,15.75 U$2.GND4 | v8.64,10.49 4.92,10.49 2.56,8.13 | U$2.GND4 19.36,16 J8_NEO_B.3 | U$2.GND4 15.75,16 14.73,17.02 14.73,20.16 15.83,21.25 Q1.2 11.96,25.4 8.04,25.4 6.8,26.64 J9_PIR3.3 6.02,29.72 | 6.02,29.72 6.02,29.92 J9_PIR1.3 | J9_PIR2.3 5.59,30.15 6.02,29.72 | Q2.2 19.91,34.8 J1.4 | S1.3 45.71,32.26 C4.2
  Top 0.254: S1.4 S1.3 | J2.GND 32.26,6.54 v32.26,7.87 | C2.2 48.4,28.4 47.75,28.4 | 47.75,28.4 MPU6050.18 | C4.2 47.75,30.22 47.75,28.4 | IC4.2 31.48,36.33 R18.2 31.79,32.54 FB2.2 FB2.1 | C18.2 29.99,35.62 v30.05,35.56 | C16.2 29.41,40.15 v29.21,39.94
  Bottom 0.203: 33.53,14.91 FTDI231XS1.6 33.6,14.86 35.18,14.86 36.12,15.8 C1.2 | IC3.1 11.73,3.81 v14.73,3.81 | IC3.7 7.83,6.06 v7.87,6.1 | IC3.4 9.78,5.71 v9.65,5.84 | IC3.10 9.13,9.99 v8.64,10.49 | 5VREG.4 28.52,42.7 V_IN.2 28.7,46.15 28.7,48.01 29.21,48.51 36.07,48.51 37.08,47.5 J7_MIC_B.2 | 38.26,18.18 38.35,18.26 44.86,18.26 J7-TMP_B1.3 | J2PHOTO_B.1 40.11,11.48 40.11,12.45 39.38,13.18 38.4,13.18 38.12,13.46 v37.08,13.46 34.18,10.56 C6.2
  Bottom 0.254: v32.26,7.87 33.78,7.87 34.18,8.27 C6.2 | v30.05,35.56 29.46,35.56 5VREG.2 | v29.21,39.94 29.21,42.01 5VREG.4
  Bottom 0.457: C12.C 23.93,34.49 J1.4 | 28.91,42.42 5VREG.4
  pour Top: 0.51,0.25 51.56,0.25 51.56,51.82 0.51,51.82
  pour Bottom: 1.02,51.31 50.8,51.31 50.8,1.27 1.02,1.27 1.02,1.52
IR_-
  Top 0.203: J5_IR_LED_B.2 13.48,20.42 Q1.3
IR_LED
  Top 0.203: Q1.1 18.01,19.62 R15.1
MIC_IN+
  Top 0.254: IC4.1 30.8,35.11 29.72,34.04 29.72,32.91 R18.1 29.86,32.77 R19.2 29.57,30.69 C14.2
MIC_IN_C14  (via drill 0.2)
  Top 0.203: J7_MIC_B.1 34.19,46.63 32.26,44.7 32.26,40.89 32,40.64 31.2,40.64 R16.2
  Top 0.254: C14.1 28.02,32.59 v27.94,33.27 | v28.7,38.35 28.3,37.95 26.34,37.95 25.91,37.52 v26.16,34.29 | v30.99,39.17 30.99,40.45 R16.2
  Bottom 0.254: v27.94,33.27 27.43,33.27 v26.16,34.29 | v28.7,38.35 30.17,38.35 v30.99,39.17
MICNET1K
  Top 0.254: R20.2 27.36,41.83 27.81,42.29 C16.1 31.12,42.28 R16.1
MISO  (via drill 0.2)
  Top 0.203: ATMEGA328P-AU.16 30.09,13.33 J1.15 22.77,6.01 R14.2 19.65,6.01 v18.8,6.86 | v12.8,11.39 12.8,13.39 U$2.DAT0
  Bottom 0.203: v18.8,6.86 17.33,6.86 v12.8,11.39
MOSI  (via drill 0.2)
  Top 0.203: ATMEGA328P-AU.15 26.16,10.52 26.16,10.49 25.2,9.63 J1.14 22.82,8.6 18.51,8.6 17.29,7.38 17.29,6.58 17.27,6.56 v17.27,4.32
  Bottom 0.203: IC3.5 9.3,3.51 9.3,3.1 9.48,2.92 15.88,2.92 v17.27,4.32
N$6
  Top 0.203: ATMEGA328P-AU.20 35.23,13.63 C9.1
N$12
  Top 0.254: U$3.1 33.85,37.79 R17.1
N$20
  Top 0.203: R11.1 20.37,31.82 Q2.1
N$22
  Bottom 0.254: D5.1 36.97,40.43 V_IN.1
N$29
  Top 0.254: R21.1 28.83,37.07 C18.1
N$30  (via drill 0.2)
  Top 0.203: IC4.3 33.13,36.36 34.38,35.11 36.4,35.11 36.75,35.46 36.75,42.49 35.54,43.7 35.54,45 35.37,45.18 33.81,45.18 33.59,44.95 C17.1
  Top 0.254: IC4.3 33.58,36.36 R17.2 32.77,34.66 v32.26,34.29 | R21.2 27.74,34.09 v27.69,34.09
  Bottom 0.254: v27.69,34.09 31.75,33.91 v32.26,34.29
PB6
  Top 0.203: OSC.1 25.84,23.58 25.84,20.58 26.61,19.89 ATMEGA328P-AU.7
PB7  (1 unrouted)
  Top 0.203: OSC.3 27.22,26.42 26.8,26.42 26.3,25.91 26.28,25.91 | 26.03,25.66 25.09,24.73 25.09,21.74 25.29,21.39 25.4,19.9 26,19.34 ATMEGA328P-AU.8
RESET
  Top 0.203: R6.2 35.93,23.71 ATMEGA328P-AU.29
  Top 0.254: R6.2 35.68,25.74 C7.2
RX  (via drill 0.2)
  Top 0.203: v32,16.15 v32,17.78
  Bottom 0.203: FTDI231XS1.4 32.04,16.19 v32,16.15 | v32,17.78 32.06,18.03 R9.1
RX-I  (via drill 0.2)
  Top 0.203: v30.36,21.72 32.1,21.13 ATMEGA328P-AU.30
  Bottom 0.203: R8.2 29.81,20.67 v30.36,21.72
SCK
  Top 0.203: ATMEGA328P-AU.17 32.38,13.34 J8.1
  Bottom 0.203: IC3.2 11.08,4.92 11.21,5.05 37.05,5.05 J8.1
SCK_BUFF  (via drill 0.2)
  Top 0.203: U$2.CLK 10.61,11.75 v10.67,11.68
  Bottom 0.203: v10.67,11.68 10.67,11.65 12.21,10.11 12.21,8.95 12.19,8.94 12.19,6.6 10.41,4.83 10.41,3.69 IC3.3
SCL  (via drill 0.2)
  Top 0.203: ATMEGA328P-AU.28 37.08,23.71 37.08,26.09 38.18,27.18 J8.9 | J8.9 39.62,27.18 | J8.9 40.3,27.18 R2.2 40.52,28.31 v40.13,28.7 | v44.45,30.99 44.45,29.09 MPU6050.23
  Bottom 0.203: v40.13,28.7 40.13,30.39 40.55,30.81 40.55,30.9 40.64,30.99 v44.45,30.99
SDA  (via drill 0.2)
  Top 0.203: ATMEGA328P-AU.27 38.86,24.37 J8.8 arc90 38.87,24.63 R1.2 v40.13,25.91 | v42.67,29.72 43.69,29.72 43.69,29.28 MPU6050.24
  Bottom 0.203: v40.13,25.91 41.4,27.18 v42.67,29.72
SS  (via drill 0.2)
  Top 0.203: ATMEGA328P-AU.14 27.5,13.01 27.41,12.9 26.36,11.94 J1.13 20.69,9.01 15.4,9.01 13.46,7.32 v10.93,7.39
  Bottom 0.203: IC3.9 8.48,8.54 8.64,8.38 9.65,8.38 v10.93,7.39
SS_BUFF  (via drill 0.2)
  Top 0.203: v8.38,11.68 8.38,13.38 U$2.CMD
  Bottom 0.203: IC3.8 7.83,11.13 v8.38,11.68
TX
  Bottom 0.203: 27.79,18.1 FTDI231XS1.20 28.18,19.04 R8.1
TX-O  (via drill 0.2)
  Top 0.203: v31.73,21.92 32.16,22.2 ATMEGA328P-AU.31
  Bottom 0.203: R9.2 31.54,21.81 v31.73,21.92
USBD_M
  Bottom 0.254: R7.2 28.21,11.86 27.47,11.86 27.28,12.05 27.28,12.71 27.47,12.9 28.07,12.9 FTDI231XS1.12
USBD_P
  Bottom 0.254: R5.2 30.99,11.94 30.54,12.38 FTDI231XS1.11
VIN  (1 unrouted)
  Bottom 0.203: 5VREG.1 32.16,36.17 35.33,32.99
  Bottom 0.457: 35.33,32.99 C15.A | 31.11,35.31 31.11,36.12 5VREG.1
VUSB  (via drill 0.2)
  Top 0.203: J2.VCC 29.62,7.39 29.39,7.62 29.39,7.87 | 29.39,7.87 29.39,11.51 30.94,13.06 31.12,13.44 31.1,14.06 29.49,15.66 v29.92,16.11 | 29.39,7.87 v25.65,7.87 25.65,5.59 24.77,4.7 C11.A
  Bottom 0.203: v29.92,16.11 28.95,15.1 28.88,15.06 28.32,15.06 FTDI231XS1.15 28.16,14.9 FB3.2 | v25.65,7.87 25.65,8.13 25.4,8.38 25.4,11.06 C5.1 25.51,12.72 FB3.1